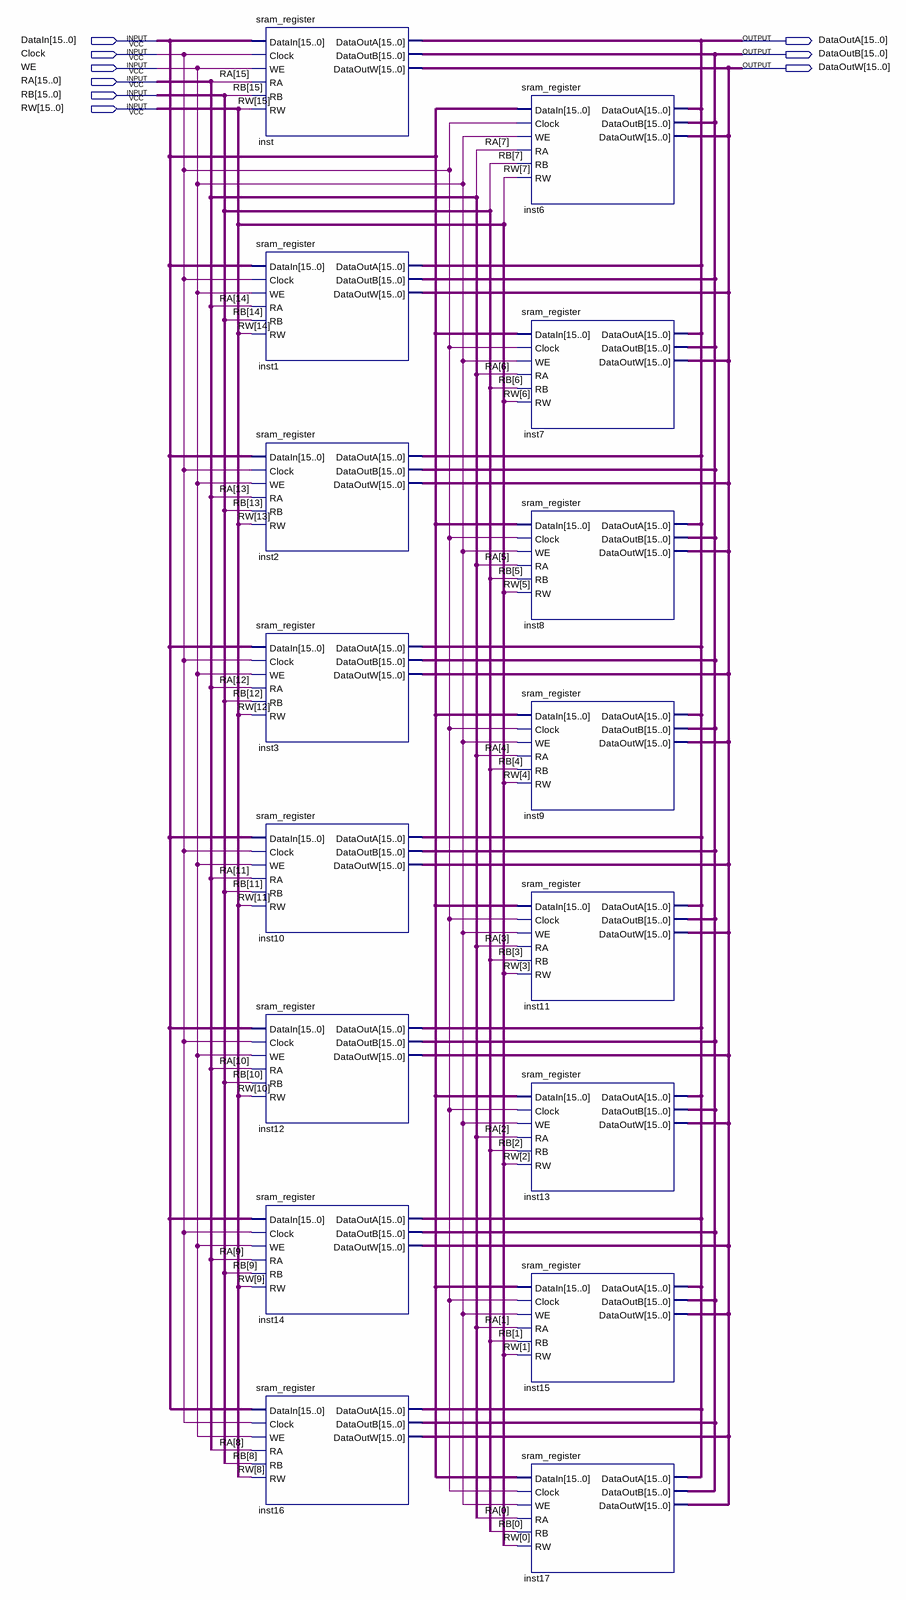
[diagram p0: schematic sheet]
// Quartus schematic sram_chip.bdf as structural Verilog: 16 symbols, 9 pins
module sram_chip (
  input  [15:0] DataIn,
  input  Clock,
  input  WE,
  input  [15:0] RA,
  input  [15:0] RB,
  input  [15:0] RW,
  output [15:0] DataOutA,
  output [15:0] DataOutB,
  output [15:0] DataOutW
);

  sram_register inst (
    .DataIn(DataIn), .Clock(Clock), .WE(WE), .RA(RA[15]), .RB(RB[15]), .RW(RW[15]), .DataOutA(DataOutA),
    .DataOutB(DataOutB), .DataOutW(DataOutW));
  sram_register inst1 (
    .DataIn(DataIn), .Clock(Clock), .WE(WE), .RA(RA[14]), .RB(RB[14]), .RW(RW[14]), .DataOutA(DataOutA),
    .DataOutB(DataOutB), .DataOutW(DataOutW));
  sram_register inst2 (
    .DataIn(DataIn), .Clock(Clock), .WE(WE), .RA(RA[13]), .RB(RB[13]), .RW(RW[13]), .DataOutA(DataOutA),
    .DataOutB(DataOutB), .DataOutW(DataOutW));
  sram_register inst3 (
    .DataIn(DataIn), .Clock(Clock), .WE(WE), .RA(RA[12]), .RB(RB[12]), .RW(RW[12]), .DataOutA(DataOutA),
    .DataOutB(DataOutB), .DataOutW(DataOutW));
  sram_register inst10 (
    .DataIn(DataIn), .Clock(Clock), .WE(WE), .RA(RA[11]), .RB(RB[11]), .RW(RW[11]), .DataOutA(DataOutA),
    .DataOutB(DataOutB), .DataOutW(DataOutW));
  sram_register inst12 (
    .DataIn(DataIn), .Clock(Clock), .WE(WE), .RA(RA[10]), .RB(RB[10]), .RW(RW[10]), .DataOutA(DataOutA),
    .DataOutB(DataOutB), .DataOutW(DataOutW));
  sram_register inst14 (
    .DataIn(DataIn), .Clock(Clock), .WE(WE), .RA(RA[9]), .RB(RB[9]), .RW(RW[9]), .DataOutA(DataOutA),
    .DataOutB(DataOutB), .DataOutW(DataOutW));
  sram_register inst16 (
    .DataIn(DataIn), .Clock(Clock), .WE(WE), .RA(RA[8]), .RB(RB[8]), .RW(RW[8]), .DataOutA(DataOutA),
    .DataOutB(DataOutB), .DataOutW(DataOutW));
  sram_register inst6 (
    .DataIn(DataIn), .Clock(Clock), .WE(WE), .RA(RA[7]), .RB(RB[7]), .RW(RW[7]), .DataOutA(DataOutA),
    .DataOutB(DataOutB), .DataOutW(DataOutW));
  sram_register inst7 (
    .DataIn(DataIn), .Clock(Clock), .WE(WE), .RA(RA[6]), .RB(RB[6]), .RW(RW[6]), .DataOutA(DataOutA),
    .DataOutB(DataOutB), .DataOutW(DataOutW));
  sram_register inst8 (
    .DataIn(DataIn), .Clock(Clock), .WE(WE), .RA(RA[5]), .RB(RB[5]), .RW(RW[5]), .DataOutA(DataOutA),
    .DataOutB(DataOutB), .DataOutW(DataOutW));
  sram_register inst9 (
    .DataIn(DataIn), .Clock(Clock), .WE(WE), .RA(RA[4]), .RB(RB[4]), .RW(RW[4]), .DataOutA(DataOutA),
    .DataOutB(DataOutB), .DataOutW(DataOutW));
  sram_register inst11 (
    .DataIn(DataIn), .Clock(Clock), .WE(WE), .RA(RA[3]), .RB(RB[3]), .RW(RW[3]), .DataOutA(DataOutA),
    .DataOutB(DataOutB), .DataOutW(DataOutW));
  sram_register inst13 (
    .DataIn(DataIn), .Clock(Clock), .WE(WE), .RA(RA[2]), .RB(RB[2]), .RW(RW[2]), .DataOutA(DataOutA),
    .DataOutB(DataOutB), .DataOutW(DataOutW));
  sram_register inst15 (
    .DataIn(DataIn), .Clock(Clock), .WE(WE), .RA(RA[1]), .RB(RB[1]), .RW(RW[1]), .DataOutA(DataOutA),
    .DataOutB(DataOutB), .DataOutW(DataOutW));
  sram_register inst17 (
    .DataIn(DataIn), .Clock(Clock), .WE(WE), .RA(RA[0]), .RB(RB[0]), .RW(RW[0]), .DataOutA(DataOutA),
    .DataOutB(DataOutB), .DataOutW(DataOutW));
endmodule
